# EAGLE schematic node5 (EAGLE 5.10)
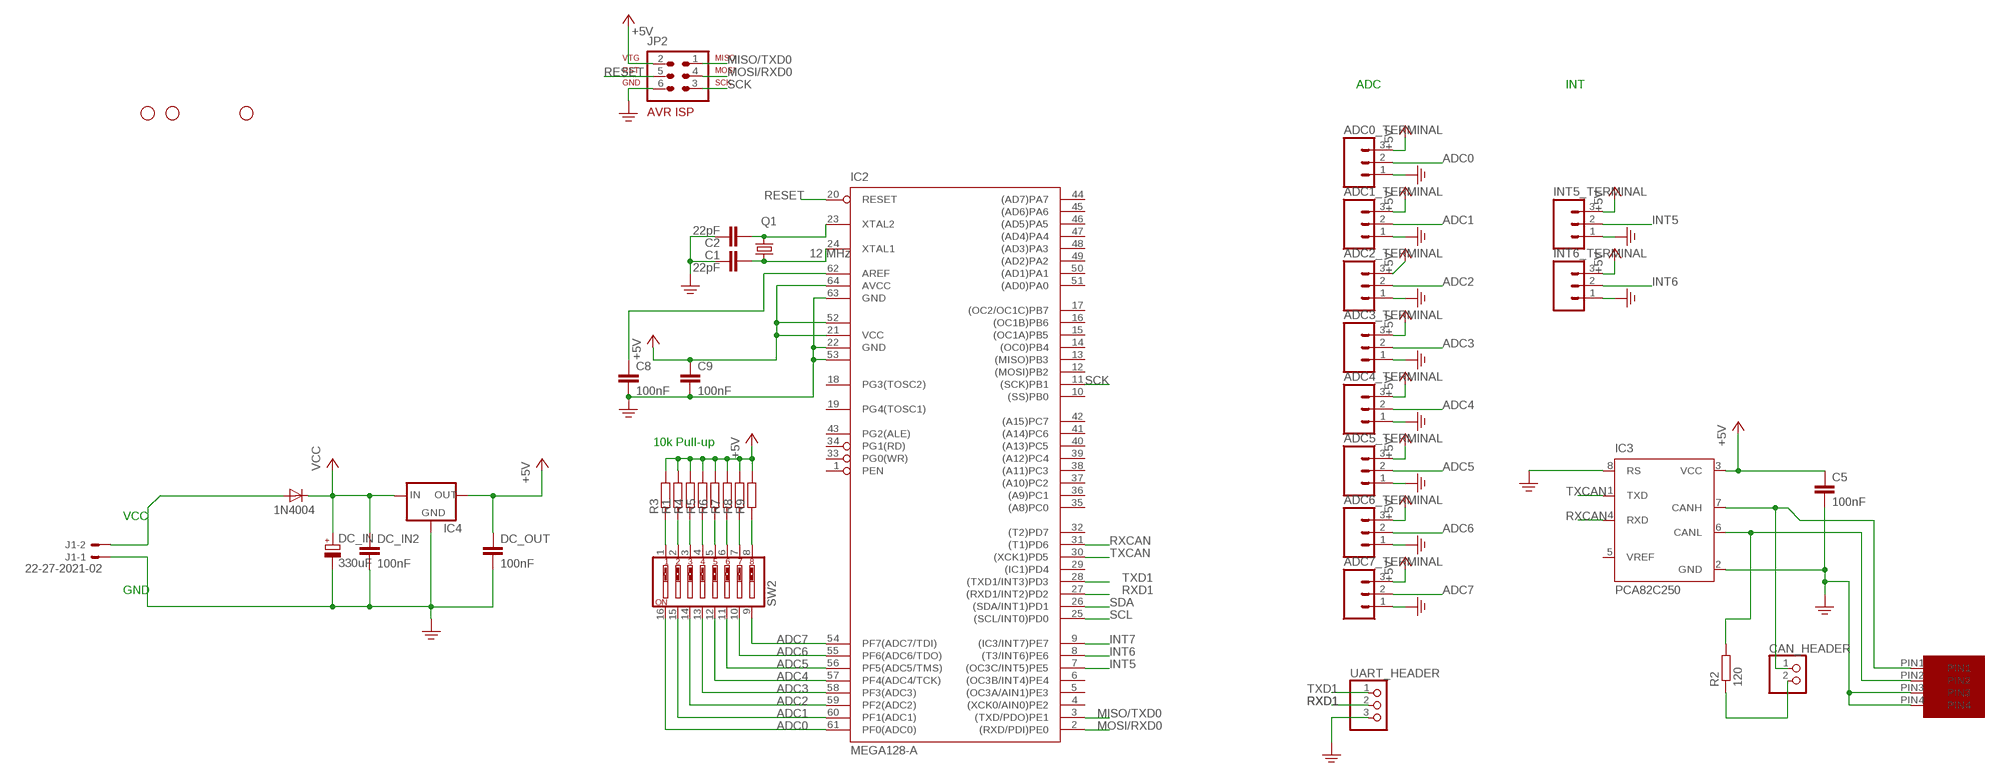
[diagram p0: schematic, sheet 1]

## Parts
ADC0_TERMINAL  M03SCREW  [SCREWTERMINAL-3.5MM-3]
ADC1_TERMINAL  M03SCREW  [SCREWTERMINAL-3.5MM-3]
ADC2_TERMINAL  M03SCREW  [SCREWTERMINAL-3.5MM-3]
ADC3_TERMINAL  M03SCREW  [SCREWTERMINAL-3.5MM-3]
ADC4_TERMINAL  M03SCREW  [SCREWTERMINAL-3.5MM-3]
ADC5_TERMINAL  M03SCREW  [SCREWTERMINAL-3.5MM-3]
ADC6_TERMINAL  M03SCREW  [SCREWTERMINAL-3.5MM-3]
ADC7_TERMINAL  M03SCREW  [SCREWTERMINAL-3.5MM-3]
C1  22pF  C5/2.5  [C5B2.5]
C2  22pF  C5/2.5  [C5B2.5]
C5  100nF  C-EU050-024X044  [C050-024X044]
C8  100nF  C-EU050-024X044  [C050-024X044]
C9  100nF  C-EU050-024X044  [C050-024X044]
CAN_HEADER  PINHD-1X2  [1X02]
DC_IN  330uF  CPOL-EUE15-5AXIAL  [E15-5]
DC_IN2  100nF  C-EU050-024X044  [C050-024X044]
DC_OUT  100nF  C-EU050-024X044  [C050-024X044]
ENSRET  1N4004  [DO41-10]
IC2  MEGA128-A  [TQFP64]
IC3  PCA82C250  [DIL08]
IC4  V_REG_78XXSIDE  [78XXL]
INT5_TERMINAL  M03SCREW  [SCREWTERMINAL-3.5MM-3]
INT6_TERMINAL  M03SCREW  [SCREWTERMINAL-3.5MM-3]
J1  22-27-2021-02  [6410-02]
JP2  AVR-ISP-6  [AVR-ISP-6]
JP3  STAND-OFF  [STAND-OFF]
JP4  STAND-OFF  [STAND-OFF]
JP6  STAND-OFF  [STAND-OFF]
Q1  12 MHz  CRYSTALHC49U70  [HC49U70]
R1  R-EU_R0603  [R0603]
R2  120  R-EU_R0603  [R0603]
R3  R-EU_R0603  [R0603]
R4  R-EU_R0603  [R0603]
R5  R-EU_R0603  [R0603]
R6  R-EU_R0603  [R0603]
R7  R-EU_R0603  [R0603]
R8  R-EU_R0603  [R0603]
R9  R-EU_R0603  [R0603]
SW2  SW_DIP-8  [DIPSWITCH-08]
U$1  MICROFIT4  [MICROFIT4SOCK]
UART_HEADER  PINHD-1X3  [1X03]

## Nets
+5V: ADC0_TERMINAL.3 ADC1_TERMINAL.3 ADC2_TERMINAL.3 ADC3_TERMINAL.3 ADC4_TERMINAL.3 ADC5_TERMINAL.3 ADC6_TERMINAL.3 ADC7_TERMINAL.3 C5.1 C9.1 DC_OUT.1 IC2.21(VCC) IC2.52(VCC1) IC2.64(AVCC) IC3.3(VCC) IC4.OUT INT5_TERMINAL.3 INT6_TERMINAL.3 JP2.2 R1.2 R3.2 R4.2 R5.2 R6.2 R7.2 R8.2 R9.2
ADC0: ADC0_TERMINAL.2 IC2.61(PF0(ADC0)) SW2.16
ADC1: ADC1_TERMINAL.2 IC2.60(PF1(ADC1)) SW2.15
ADC2: ADC2_TERMINAL.2 IC2.59(PF2(ADC2)) SW2.14
ADC3: ADC3_TERMINAL.2 IC2.58(PF3(ADC3)) SW2.13
ADC4: ADC4_TERMINAL.2 IC2.57(PF4(ADC4/TCK)) SW2.12
ADC5: ADC5_TERMINAL.2 IC2.56(PF5(ADC5/TMS)) SW2.11
ADC6: ADC6_TERMINAL.2 IC2.55(PF6(ADC6/TDO)) SW2.10
ADC7: ADC7_TERMINAL.2 IC2.54(PF7(ADC7/TDI)) SW2.9
CANJUMP1: CAN_HEADER.1 IC3.7(CANH) U$1.PIN1
CANJUMP2: CAN_HEADER.2 R2.1
INT5: IC2.7((OC3C/INT5)PE5) INT5_TERMINAL.2
INT6: IC2.8((T3/INT6)PE6) INT6_TERMINAL.2
INT7: IC2.9((IC3/INT7)PE7)
MISO/TXD0: IC2.3((TXD/PDO)PE1) JP2.1
MOSI/RXD0: IC2.2((RXD/PDI)PE0) JP2.4
N$1: C1.2 IC2.24(XTAL1) Q1.1
N$2: C2.2 IC2.23(XTAL2) Q1.2
N$3: R1.1 SW2.2
N$4: R3.1 SW2.1
N$5: ENSRET.A J1.2
N$7: R4.1 SW2.3
N$10: C8.1 IC2.62(AREF)
N$14: R5.1 SW2.4
N$15: R6.1 SW2.5
N$16: R7.1 SW2.6
N$17: R8.1 SW2.7
N$20: R9.1 SW2.8
N$51: IC3.6(CANL) R2.2 U$1.PIN2
PE: ADC0_TERMINAL.1 ADC1_TERMINAL.1 ADC2_TERMINAL.1 ADC3_TERMINAL.1 ADC4_TERMINAL.1 ADC5_TERMINAL.1 ADC6_TERMINAL.1 ADC7_TERMINAL.1 C1.1 C2.1 C5.2 C8.2 C9.2 DC_IN2.2 DC_IN.- DC_OUT.2 IC2.22(GND) IC2.53(GND1) IC2.63(GND) IC3.2(GND) IC3.8(RS) IC4.GND INT5_TERMINAL.1 INT6_TERMINAL.1 J1.1 JP2.6 U$1.PIN3 U$1.PIN4 UART_HEADER.3
RESET: IC2.20(RESET) JP2.5
RXCAN: IC2.31((T1)PD6) IC3.4(RXD)
RXD1: IC2.27((RXD1/INT2)PD2) UART_HEADER.2
SCK: IC2.11((SCK)PB1) JP2.3
SCL: IC2.25((SCL/INT0)PD0)
SDA: IC2.26((SDA/INT1)PD1)
TXCAN: IC2.30((XCK1)PD5) IC3.1(TXD)
TXD1: IC2.28((TXD1/INT3)PD3) UART_HEADER.1
VCC: DC_IN2.1 DC_IN.+ ENSRET.C IC4.IN
Unconnected: IC2.1(PEN) IC2.4((XCK0/AIN0)PE2) IC2.5((OC3A/AIN1)PE3) IC2.6((OC3B/INT4)PE4) IC2.10((SS)PB0) IC2.12((MOSI)PB2) IC2.13((MISO)PB3) IC2.14((OC0)PB4) IC2.15((OC1A)PB5) IC2.16((OC1B)PB6) IC2.17((OC2/OC1C)PB7) IC2.18(PG3(TOSC2)) IC2.19(PG4(TOSC1)) IC2.29((IC1)PD4) IC2.32((T2)PD7) IC2.33(PG0(WR)) IC2.34(PG1(RD)) IC2.35((A8)PC0) IC2.36((A9)PC1) IC2.37((A10)PC2) IC2.38((A11)PC3) IC2.39((A12)PC4) IC2.40((A13)PC5) IC2.41((A14)PC6) IC2.42((A15)PC7) IC2.43(PG2(ALE)) IC2.44((AD7)PA7) IC2.45((AD6)PA6) IC2.46((AD5)PA5) IC2.47((AD4)PA4) IC2.48((AD3)PA3) IC2.49((AD2)PA2) IC2.50((AD1)PA1) IC2.51((AD0)PA0) IC3.5(VREF)

## Notes on the sheet
- ADC | INT
- 10k Pull-up
- VCC
- GND

## Library data of the parts
ADC0_TERMINAL ADC1_TERMINAL ADC2_TERMINAL ADC3_TERMINAL ADC4_TERMINAL ADC5_TERMINAL ADC6_TERMINAL ADC7_TERMINAL INT5_TERMINAL INT6_TERMINAL = SparkFun:M03: Header 3 Standard 3-pin 0.1" header. Use with straight break away headers (SKU : PRT-00116), right angle break away headers (PRT-00553), swiss pins (PRT-00743), machine pins (PRT-00117), and female headers (PRT-00115). Molex polarized connector foot print use with SKU : PRT-08232 with associated crimp pins and housings.
C1 C2 = capacitor-wima:C: CAPACITOR naming: grid - package width
C5 C8 C9 DC_IN2 DC_OUT = rcl:C-EU: CAPACITOR, European symbol
CAN_HEADER = pinhead:PINHD-1X2: PIN HEADER
DC_IN = rcl:CPOL-EU: POLARIZED CAPACITOR, European symbol
ENSRET = diode:1N4004: DIODE general purpose rectifier, 1 A
IC2 = atmel:MEGA128: MICROCONTROLLER 128 Kbytes FLASH 4 Kbytes SRAM 4 Kbytes EEPROM DUAL USART 8-channel 10 bit ADC Source: avr.lbr
IC3 = micro-philips:PCA82C250: CAN CONTROLLER INTERFACE
IC4 = SparkFun:V_REG_78XX: Voltage Regulator Standard 7805 5V regulator. IGO (Input Ground Output). Spark Fun Electronics SKU : COM-00107
J1 = con-molex:22-?-02: CONNECTOR wire to board 2.54 mm (.1 inch) pitch header
JP2 = avr-5:AVR-ISP-6: AVR ISP-6 Serial Programming Header
JP3 JP4 JP6 = SparkFun:STAND-OFF: Stand Off This is the mechanical footprint for a #4 phillips button head screw. Use the keepout ring to avoid running the screw head into surrounding components. SKU : PRT-00447
Q1 = crystal:CRYSTAL: CRYSTAL
R1-R9 = resistor:R-EU_: RESISTOR, European symbol
SW2 = SparkFun:SW_DIP-8: DIP Switch 8 Position Spark Fun Electronics SKU : COM-08034
U$1 = UNICORN:MICROFIT4
UART_HEADER = pinhead:PINHD-1X3: PIN HEADER